# Altium project Pmod_RS232.PrjPcb
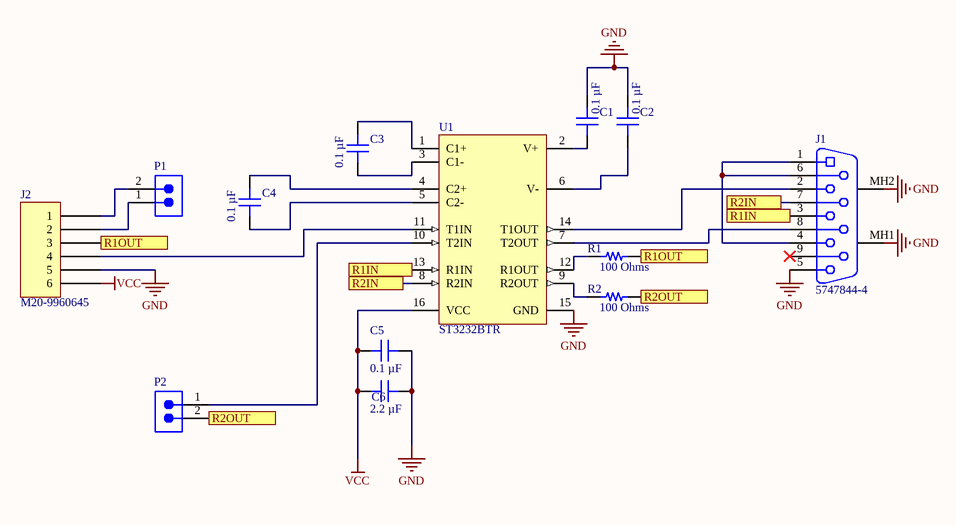
[diagram p0: Pmod_RS232.SchDoc]
1 sheet, 13 parts. Net scope: flat (ports and power ports of the same name join across sheets).
Board file: Pmod_RS232.PcbDoc

## Sheet Pmod_RS232.SchDoc
size A4; SheetNumber: 1; SheetTotal: 1

### Parts
C1  0.1 µF  [CAP 0805_2012]
C2  0.1 µF  [CAP 0805_2012]
C3  0.1 µF  [CAP 0805_2012]
C4  0.1 µF  [CAP 0805_2012]
C5  0.1 µF  [CAP 0805_2012]
C6  2.2 µF  [CAP 0805_2012]
J1  5747844-4  [TE-5747844-4_V]
J2  M20-9960645  [HARWIN M20-9960645]
P1  TSW-102-26-L-S  [SMTC-TSW-102-26-XX-S]  (value not drawn)
P2  TSW-102-26-L-S  [SMTC-TSW-102-26-XX-S]  (value not drawn)
R1  100 Ohms  [RES 0805_2012]
R2  100 Ohms  [RES 0805_2012]
U1  ST3232BTR  [STM-TSSOP-16_L]

### Ports
R1IN (see Pmod_RS232[2B]), R1IN (see Pmod_RS232[3B]), R1OUT (see Pmod_RS232[1B]), R1OUT (see Pmod_RS232[3B]), R2IN (see Pmod_RS232[2B]), R2IN (see Pmod_RS232[3B]), R2OUT (see Pmod_RS232[2C]), R2OUT (see Pmod_RS232[3B])

### Nets
GND: C1.2 C2.2 C5.1 C6.2 J1.5 J1.MH1 J1.MH2 J2.5 U1.15(GND)
VCC: C5.2 C6.1 J2.6 U1.16(VCC)
NetC1_1: C1.1 U1.2(V+)
NetC2_1: C2.1 U1.6(V-)
NetC3_1: C3.1 U1.3(C1-)
NetC3_2: C3.2 U1.1(C1+)
NetC4_1: C4.1 U1.5(C2-)
NetC4_2: C4.2 U1.4(C2+)
NetJ1_1: J1.1 J1.4 J1.6
NetJ1_2: J1.2 U1.14(T1OUT)
NetJ1_3: J1.3 U1.13(R1IN) ; port R1IN
NetJ1_7: J1.7 U1.8(R2IN) ; port R2IN
NetJ1_8: J1.8 U1.7(T2OUT)
NetJ2_1: J2.1 P1.2
NetJ2_2: J2.2 P1.1
NetJ2_3: J2.3 R1.2 ; port R1OUT
NetJ2_4: J2.4 U1.11(T1IN)
NetP2_1: P2.1 U1.10(T2IN)
NetP2_2: P2.2 R2.2 ; port R2OUT
NetR1_1: R1.1 U1.12(R1OUT)
NetR2_1: R2.1 U1.9(R2OUT)

Not connected (* = marked no-connect by the designer): J1 9*

### Library data of the parts
C1-C5 = CC0805MRX7R9BB104: CAP CER 0.1UF 50V X7R 0805; Part Number: CC0805MRX7R9BB104; Value: 0.1 µF
C6 = CL21A225KB9LNNC: CAP CER 2.2UF 50V X5R 0805; Part Number: CL21A225KB9LNNC; Value: 2.2 µF
J1 = CMP-1684-00001-6: Female D-Sub Receptacle, Pitch 1.3716 mm, 9 Position, Height 12.9286 mm, -55 to 105 degC, RoHS, Tray; Manufacturer: TE Connectivity; Voltage Rating: 125 V; Current Rating: 6 A; Rows: 2; Mounting Technology: Through Hole; Height: 12.54 mm; Lead Pitch: 2.74 mm; ComponentLink1Description: Manufacturer URL; DatasheetVersion: Rev. P, 03/2011; ComponentLink2Description: Datasheet; REACH SVHC: No SVHC; Max Operating Temperature: 105 degC; Contact Material: Bronze; Mount: Through Hole; Contact Plating: Gold; Colour: Black; ComponentLink1URL: http://www.te.com/; RoHSCompliant: true; Min Operating Temperature: -55 degC; PackageReference: 5747844-4; Contact Finish: Gold; Packaging: Tray; Pins: 9; Length: 30.81 mm; Package Quantity: 130; PackageDescription: Female D-Sub Receptacle, Pitch 1.3716 mm, 9 Position, Height 12.9286 mm; ComponentLink2URL: http://www.te.com/commerce/DocumentDelivery/DDEController?Action=srchrtrv&DocNm=5747844&DocType=Customer+Drawing&DocLang=English
J2 = M20-9960645: CONN HEADER R/A 6POS 2.54MM; Part Number: M20-9960645
P1 P2 = CMP-1024-00330-1: 0.025" SQ Post Header, Through-hole, Vertical, -55 to 125 degC, 2.54 mm Pitch, 2-Pin, Male, RoHS; Manufacturer: Samtec; Pitch: 2.54 mm; DatasheetVersion: F-214; PackageReference: TSW-102-26-XX-S; ComponentLink3Description: Package Specification; PackageDescription: .025[0.64] SQ. Post Terminal Strip Assembly; PackageVersion: DM, 8/1988; ComponentLink1Description: Manufacturer URL; ComponentLink2URL: http://www.samtec.com/documents/webfiles/pdf/TSW_TH.PDF; ComponentLink3URL: http://www.samtec.com/documents/webfiles/cpdf/TSW-XXX-XX-XXX-X-XX-XXX-MKT.pdf; ComponentLink2Description: Datasheet; Temperature Range: -55 to 125 degC; Mounting Technology: Through-hole; ComponentLink1URL: http://www.samtec.com; RoHS: True; PartNumber: TSW-102-26-L-S; Orientation: Vertical
R1 R2 = RQ73C2A100RBTDF: RQ 0805 100R 0.1% 10PPM 1K RL; Part Number: RQ73C2A100RBTDF; Value: 100 Ohms
U1 = CMP-2000-07155-1: RS-232 Driver and Receiver, 3 to 5.5 V, -40 to 85 degC, 16-Pin TSSOP, RoHS, Tape and Reel; Manufacturer: STMicroelectronics; Dual Supply Voltage (Min): NotRequiredV; Power Supply Requirement: Single; Receiver Signal Type: Single-Ended; Number of Transmitters: 2; Single Supply Voltage (Typ): 3.3/5V; Supply Current: 2mA; Single Supply Voltage (Min): 3V; DELETED: Compliant; Data Rate: 0.4kbps; Number of Transceivers: 1; Rad Hardened: No; Single Supply Voltage (Max): 5.5V; Data Transmission Topology: Point-to-Point; Datasheet URL: http://www.st.com/content/ccc/resource/technical/document/datasheet/group1/40/2c/7f/62/3a/3f/47/3c/CD00002253/files/CD00002253.pdf/jcr:content/translations/en.CD00002253.pdf; Dual Supply Voltage (Max): NotRequiredV; Packaging: TapeandReel; Mounting Technology: SurfaceMount; Package Reference: TSSOP-16; Operating Temperature Classification: Industrial; Package Description: 16-Pin Thin Shrink Small Outline Package, Body 5 x 4.4 mm, Pitch 0.65 mm; Operating Temp Range: -40Cto85C; Manufacturer URL: http://www.st.com/; Datasheet Version: Rev. 12, 01/2016; Mounting: SurfaceMount; Dual Supply Voltage (Typ): NotRequiredV; Pin Count: 16; Number of Receivers: 2; Package Type: TSSOP; Interface Circuit Standard 1: RS-232; Transmitter Signal Type: Single-Ended